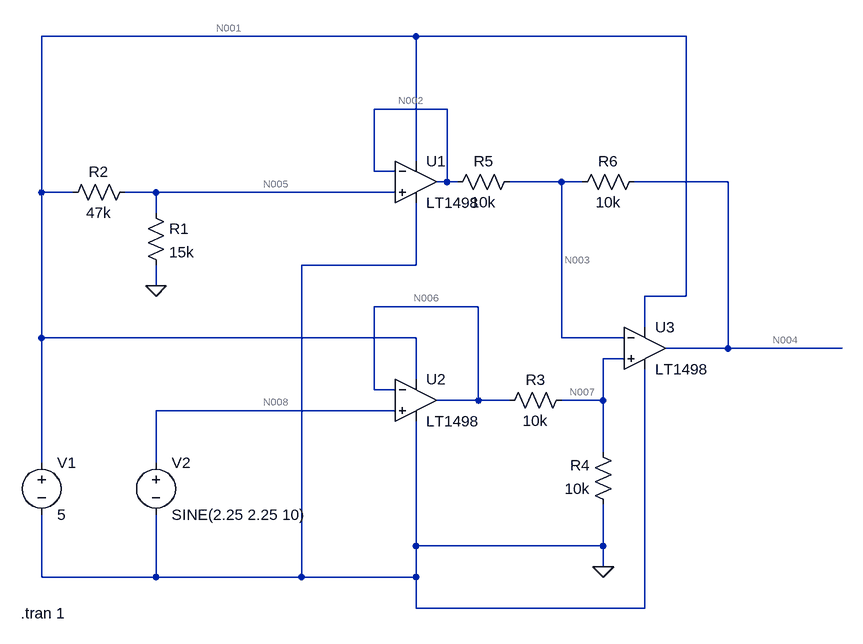
[diagram p0: schematic Analog.asc]
Analog.asc, the LTspice schematic file:
Version 4
SHEET 1 1284 680
WIRE 624 -528 48 -528
WIRE 1040 -528 624 -528
WIRE 672 -416 560 -416
WIRE 624 -336 624 -528
WIRE 560 -320 560 -416
WIRE 592 -320 560 -320
WIRE 672 -304 672 -416
WIRE 672 -304 656 -304
WIRE 688 -304 672 -304
WIRE 848 -304 768 -304
WIRE 880 -304 848 -304
WIRE 1104 -304 960 -304
WIRE 48 -288 48 -528
WIRE 96 -288 48 -288
WIRE 224 -288 176 -288
WIRE 592 -288 224 -288
WIRE 224 -256 224 -288
WIRE 624 -176 624 -272
WIRE 624 -176 448 -176
WIRE 224 -144 224 -176
WIRE 1040 -128 1040 -528
WIRE 1040 -128 976 -128
WIRE 720 -112 560 -112
WIRE 976 -80 976 -128
WIRE 48 -64 48 -288
WIRE 624 -64 48 -64
WIRE 848 -64 848 -304
WIRE 944 -64 848 -64
WIRE 1104 -48 1104 -304
WIRE 1104 -48 1008 -48
WIRE 1280 -48 1104 -48
WIRE 944 -32 912 -32
WIRE 624 0 624 -64
WIRE 560 16 560 -112
WIRE 592 16 560 16
WIRE 720 32 720 -112
WIRE 720 32 656 32
WIRE 768 32 720 32
WIRE 912 32 912 -32
WIRE 912 32 848 32
WIRE 592 48 224 48
WIRE 912 112 912 32
WIRE 48 128 48 -64
WIRE 224 128 224 48
WIRE 624 256 624 64
WIRE 912 256 912 192
WIRE 912 256 624 256
WIRE 912 288 912 256
WIRE 48 304 48 208
WIRE 224 304 224 208
WIRE 224 304 48 304
WIRE 448 304 448 -176
WIRE 448 304 224 304
WIRE 624 304 624 256
WIRE 624 304 448 304
WIRE 624 352 624 304
WIRE 976 352 976 -16
WIRE 976 352 624 352
FLAG 224 -144 0
FLAG 912 288 0
SYMBOL voltage 48 112 R0
WINDOW 123 0 0 Left 0
WINDOW 39 0 0 Left 0
SYMATTR InstName V1
SYMATTR Value 5
SYMBOL voltage 224 112 R0
WINDOW 123 0 0 Left 0
WINDOW 39 0 0 Left 0
SYMATTR InstName V2
SYMATTR Value SINE(2.25 2.25 10)
SYMBOL res 208 -272 R0
SYMATTR InstName R1
SYMATTR Value 15k
SYMBOL res 192 -304 R90
WINDOW 0 0 56 VBottom 2
WINDOW 3 32 56 VTop 2
SYMATTR InstName R2
SYMATTR Value 47k
SYMBOL res 864 16 R90
WINDOW 0 0 56 VBottom 2
WINDOW 3 32 56 VTop 2
SYMATTR InstName R3
SYMATTR Value 10k
SYMBOL res 928 208 R180
WINDOW 0 36 76 Left 2
WINDOW 3 36 40 Left 2
SYMATTR InstName R4
SYMATTR Value 10k
SYMBOL res 784 -320 R90
WINDOW 0 0 56 VBottom 2
WINDOW 3 32 56 VTop 2
SYMATTR InstName R5
SYMATTR Value 10k
SYMBOL res 976 -320 R90
WINDOW 0 0 56 VBottom 2
WINDOW 3 32 56 VTop 2
SYMATTR InstName R6
SYMATTR Value 10k
SYMBOL OpAmps\\LT1498 624 -368 R0
SYMATTR InstName U1
SYMBOL OpAmps\\LT1498 624 -32 R0
SYMATTR InstName U2
SYMBOL OpAmps\\LT1498 976 -112 R0
SYMATTR InstName U3
TEXT 16 360 Left 2 !.tran 1

The netlist it stands for:
* Analog.asc
V1 N001 0 5
V2 N008 0 SINE(2.25 2.25 10)
R1 N005 0 15k
R2 N005 N001 47k
R3 N007 N006 10k
R4 0 N007 10k
R5 N003 N002 10k
R6 N004 N003 10k
XU1 N005 N002 N001 0 N002 LT1498  ; pins In+ In- V+ V- OUT
XU2 N008 N006 N001 0 N006 LT1498  ; pins In+ In- V+ V- OUT
XU3 N007 N003 N001 0 N004 LT1498  ; pins In+ In- V+ V- OUT
.tran 1
.lib LTC.lib
.backanno
.end

* Results of the author's LTspice run, read from the files saved beside the schematic
* Operating Point, zero values left out:
*   V(n001) = 5 V
*   V(n008) = 2.25 V
*   V(n005) = 1.213 V
*   V(n007) = 1.126 V
*   V(n006) = 2.25 V
*   V(n003) = 1.126 V
*   V(n002) = 1.213 V
*   V(n004) = 1.037 V
*   I(R1) = 80.84 µA
*   I(R2) = -80.58 µA
*   I(R3) = -112.4 µA
*   I(R4) = -112.6 µA
*   I(R5) = -8.629 µA
*   I(R6) = -8.881 µA
*   I(V1) = -5.234 mA
*   I(V2) = 250.5 nA
*   Ix(u1:1) = -252.7 nA
*   Ix(u1:2) = -252.7 nA
*   Ix(u1:3) = 1.704 mA
*   Ix(u1:4) = -1.695 mA
*   Ix(u1:5) = -8.376 µA
*   Ix(u2:1) = -250.5 nA
*   Ix(u2:2) = -250.5 nA
*   Ix(u2:3) = 1.753 mA
*   Ix(u2:4) = -1.64 mA
*   Ix(u2:5) = -112.1 µA
*   Ix(u3:1) = -252.9 nA
*   Ix(u3:2) = -252.9 nA
*   Ix(u3:3) = 1.696 mA
*   Ix(u3:4) = -1.705 mA
*   Ix(u3:5) = 8.881 µA
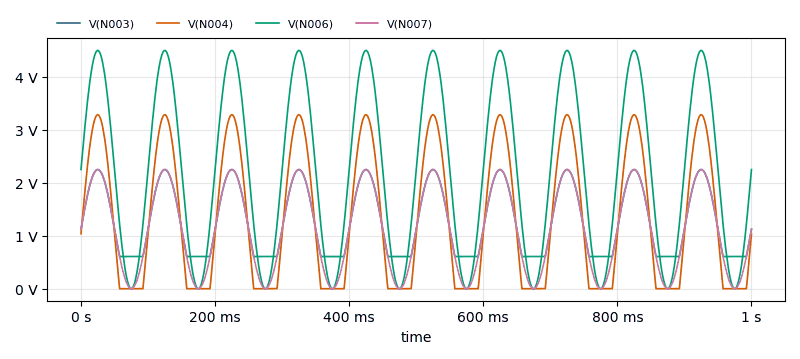
[diagram p1: Transient Analysis of Analog.asc, plotted from the saved traces]
* Transient Analysis, 1 run:
*   V(N003): min 608.4 mV, max 2.25 V, average 1.263 V, rms 1.415 V, last 1.126 V
*   V(N004): min 1.787 mV, max 3.285 V, average 1.312 V, rms 1.827 V, last 1.037 V
*   V(N006): min 118.7 µV, max 4.497 V, average 2.25 V, rms 2.755 V, last 2.25 V
*   V(N007): min 1.369 mV, max 2.25 V, average 1.126 V, rms 1.378 V, last 1.126 V